# Altium schematic sheet 10_FE_LANPORT.SchDoc
size A4; SheetNumber: 11; SheetTotal: 11
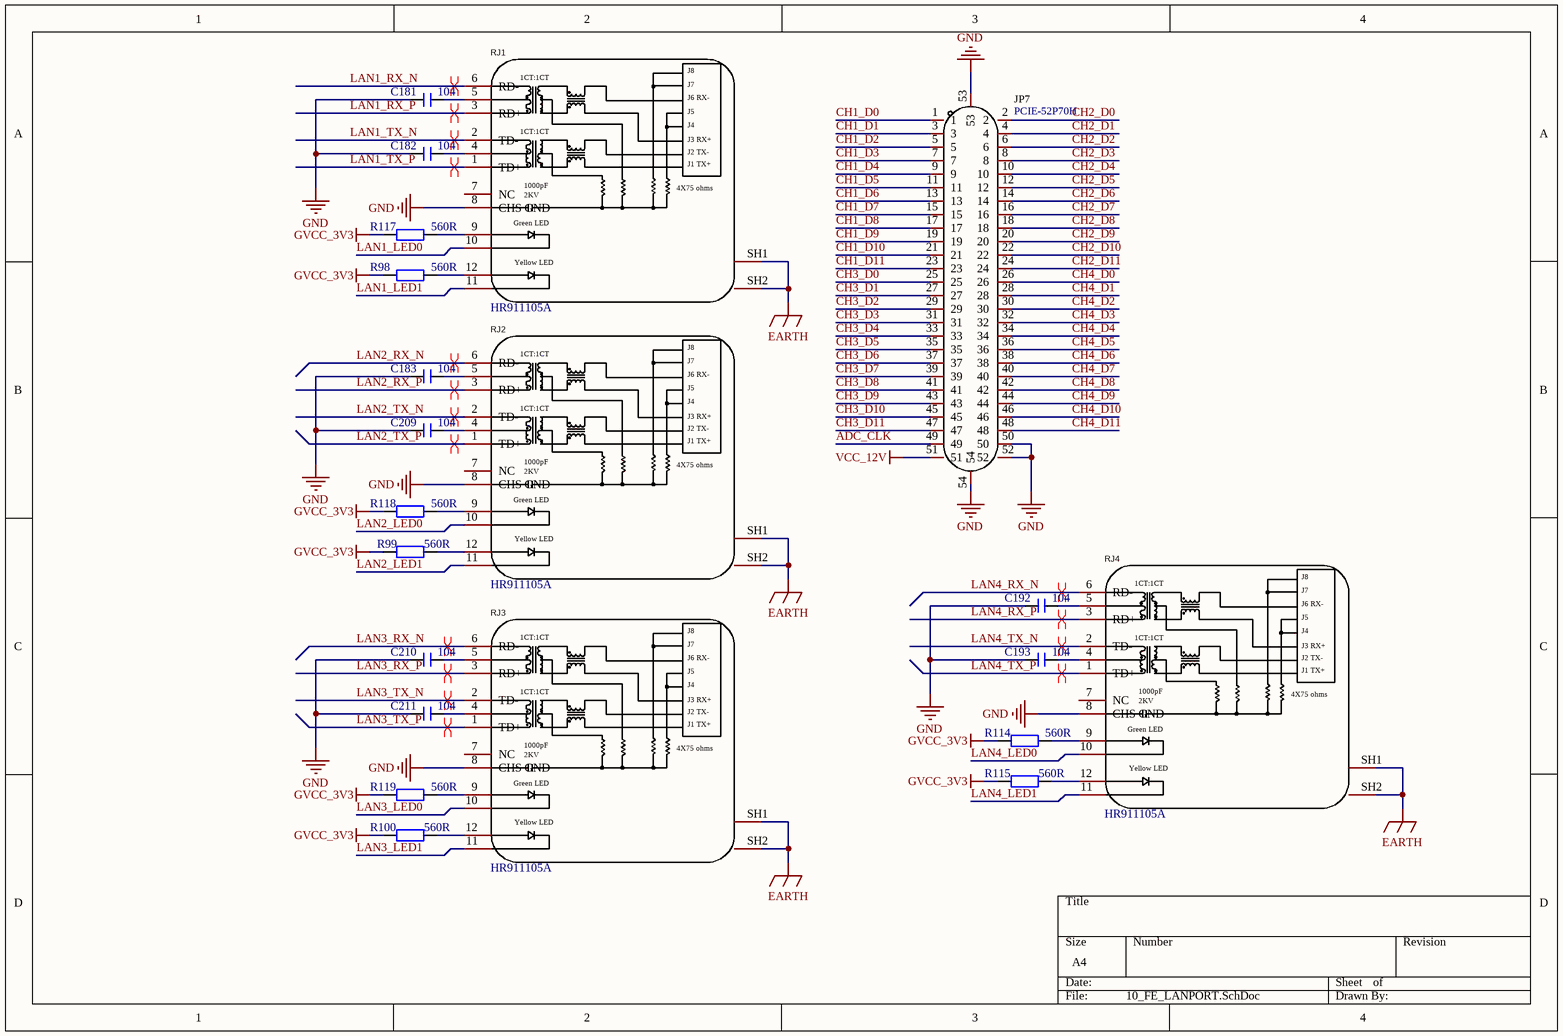
[diagram p0: 10_FE_LANPORT.SchDoc]

## Parts
C181  104  [C 0603]
C182  104  [C 0603]
C183  104  [C 0603]
C192  104  [C 0603]
C193  104  [C 0603]
C209  104  [C 0603]
C210  104  [C 0603]
C211  104  [C 0603]
JP7  PCIE-52P70H  [MINI PCIe]
R98  560R  [R 0603]
R99  560R  [R 0603]
R100  560R  [R 0603]
R114  560R  [R 0603]
R115  560R  [R 0603]
R117  560R  [R 0603]
R118  560R  [R 0603]
R119  560R  [R 0603]
RJ1  HR911105A  [HR91105A]
RJ2  HR911105A  [HR91105A]
RJ3  HR911105A  [HR91105A]
RJ4  HR911105A  [HR91105A]

## Nets
EARTH: RJ1.SH1 RJ1.SH2 RJ2.SH1 RJ2.SH2 RJ3.SH1 RJ3.SH2 RJ4.SH1 RJ4.SH2
GND: C181.1 C182.2 C183.2 C192.1 C193.1 C209.1 C210.1 C211.1 JP7.50 JP7.52 JP7.53 JP7.54 RJ1.8(CHS_GND) RJ2.8(CHS_GND) RJ3.8(CHS_GND) RJ4.8(CHS_GND)
GVCC_3V3: R98.2 R99.1 R100.1 R114.2 R115.1 R117.2 R118.2 R119.2
VCC_12V: JP7.51
ADC_CLK: JP7.49
CH1_D0: JP7.1
CH1_D1: JP7.3
CH1_D2: JP7.5
CH1_D3: JP7.7
CH1_D4: JP7.9
CH1_D5: JP7.11
CH1_D6: JP7.13
CH1_D7: JP7.15
CH1_D8: JP7.17
CH1_D9: JP7.19
CH1_D10: JP7.21
CH1_D11: JP7.23
CH2_D0: JP7.2
CH2_D1: JP7.4
CH2_D2: JP7.6
CH2_D3: JP7.8
CH2_D4: JP7.10
CH2_D5: JP7.12
CH2_D6: JP7.14
CH2_D7: JP7.16
CH2_D8: JP7.18
CH2_D9: JP7.20
CH2_D10: JP7.22
CH2_D11: JP7.24
CH3_D0: JP7.25
CH3_D1: JP7.27
CH3_D2: JP7.29
CH3_D3: JP7.31
CH3_D4: JP7.33
CH3_D5: JP7.35
CH3_D6: JP7.37
CH3_D7: JP7.39
CH3_D8: JP7.41
CH3_D9: JP7.43
CH3_D10: JP7.45
CH3_D11: JP7.47
CH4_D0: JP7.26
CH4_D1: JP7.28
CH4_D2: JP7.30
CH4_D3: JP7.32
CH4_D4: JP7.34
CH4_D5: JP7.36
CH4_D6: JP7.38
CH4_D7: JP7.40
CH4_D8: JP7.42
CH4_D9: JP7.44
CH4_D10: JP7.46
CH4_D11: JP7.48
LAN1_LED0: RJ1.10
LAN1_LED1: RJ1.11
LAN1_RX_N: RJ1.6(RD-)
LAN1_RX_P: RJ1.3(RD+)
LAN1_TX_N: RJ1.2(TD-)
LAN1_TX_P: RJ1.1(TD+)
LAN2_LED0: RJ2.10
LAN2_LED1: RJ2.11
LAN2_RX_N: RJ2.6(RD-)
LAN2_RX_P: RJ2.3(RD+)
LAN2_TX_N: RJ2.2(TD-)
LAN2_TX_P: RJ2.1(TD+)
LAN3_LED0: RJ3.10
LAN3_LED1: RJ3.11
LAN3_RX_N: RJ3.6(RD-)
LAN3_RX_P: RJ3.3(RD+)
LAN3_TX_N: RJ3.2(TD-)
LAN3_TX_P: RJ3.1(TD+)
LAN4_LED0: RJ4.10
LAN4_LED1: RJ4.11
LAN4_RX_N: RJ4.6(RD-)
LAN4_RX_P: RJ4.3(RD+)
LAN4_TX_N: RJ4.2(TD-)
LAN4_TX_P: RJ4.1(TD+)
NetC181_2: C181.2 RJ1.5
NetC182_1: C182.1 RJ1.4
NetC183_1: C183.1 RJ2.5
NetC192_2: C192.2 RJ4.5
NetC193_2: C193.2 RJ4.4
NetC209_2: C209.2 RJ2.4
NetC210_2: C210.2 RJ3.5
NetC211_2: C211.2 RJ3.4
NetR98_1: R98.1 RJ1.12
NetR99_2: R99.2 RJ2.12
NetR100_2: R100.2 RJ3.12
NetR114_1: R114.1 RJ4.9
NetR115_2: R115.2 RJ4.12
NetR117_1: R117.1 RJ1.9
NetR118_1: R118.1 RJ2.9
NetR119_1: R119.1 RJ3.9

Not connected (* = marked no-connect by the designer): RJ1 7(NC); RJ2 7(NC); RJ3 7(NC); RJ4 7(NC)

## Layout directives
differential pair: LAN1_RX_N, LAN1_RX_P, LAN1_TX_N, LAN1_TX_P, LAN2_RX_N, LAN2_RX_P, LAN2_TX_N, LAN2_TX_P, LAN3_RX_N, LAN3_RX_P, LAN3_TX_N, LAN3_TX_P, LAN4_RX_N, LAN4_RX_P, LAN4_TX_N, LAN4_TX_P

## Notes on the sheet
- (in symbol HR911105A) J8; 1CT:1CT; J7; J6 RX-; J5; J4; J3 RX+; J2 TX-; J1 TX+; 1000pF; 4X75 ohms; 2KV; Green LED; Yellow LED

## Library data of the parts
C181-C183 C192 C193 C209-C211 = C: 无极性贴片电容; 版权归属: 源创客; BOM名称: 无极性贴片电容; 学习资源: www.ooocke.com
JP7 = PCIE-52P70H: Manufacturer: XUNPU(讯普); Symbol: PCIE-52P70H_C2982554; Add into BOM: yes; Name: PCIE-52P70H; Device: PCIE-52P70H; LCSC Part Name: PCIE-52P70H; Supplier Part: C2982554; Manufacturer Part: PCIE-52P70H; Supplier Footprint: SMD,P=0.8mm; JLCPCB Part Class: Extended Part; Datasheet: https://atta.szlcsc.com/upload/public/pdf/source/20220311/DC8B167F9A8E29C645B8AA97E9059897.pdf; Supplier: LCSC; Convert to PCB: yes
R98-R100 R114 R115 R117-R119 = R: 贴片电阻; 版权归属: 源创客; BOM名称: 贴片电阻; 学习资源: www.ooocke.com
RJ1-RJ4 = HR911105A: Manufacturer: HANRUN(汉仁); Symbol: HR911105A_C12074; Add into BOM: yes; Connector Type: RJ插座; USOC Codes: RJ45; Number of Ports: 1; LED: 带LED; Name: HR911105A; Device: HR911105A_C12074; LCSC Part Name: RJ45 带LED 带LED灯; Supplier Part: C12074; Manufacturer Part: HR911105A; Supplier Footprint: 插件; JLCPCB Part Class: Extended Part; Datasheet: https://atta.szlcsc.com/upload/public/pdf/source/20170918/C12074_1505726819496976146.pdf; Supplier: LCSC; Convert to PCB: yes; Ratings: -; Shielding: -